# EasyEDA schematic HW_SCH.json
TITLE: Sheet_1; REV: 1.0; Date: 2022-10-19; Sheet: 1/1; Drawn By: rohirto; Company: Your Company
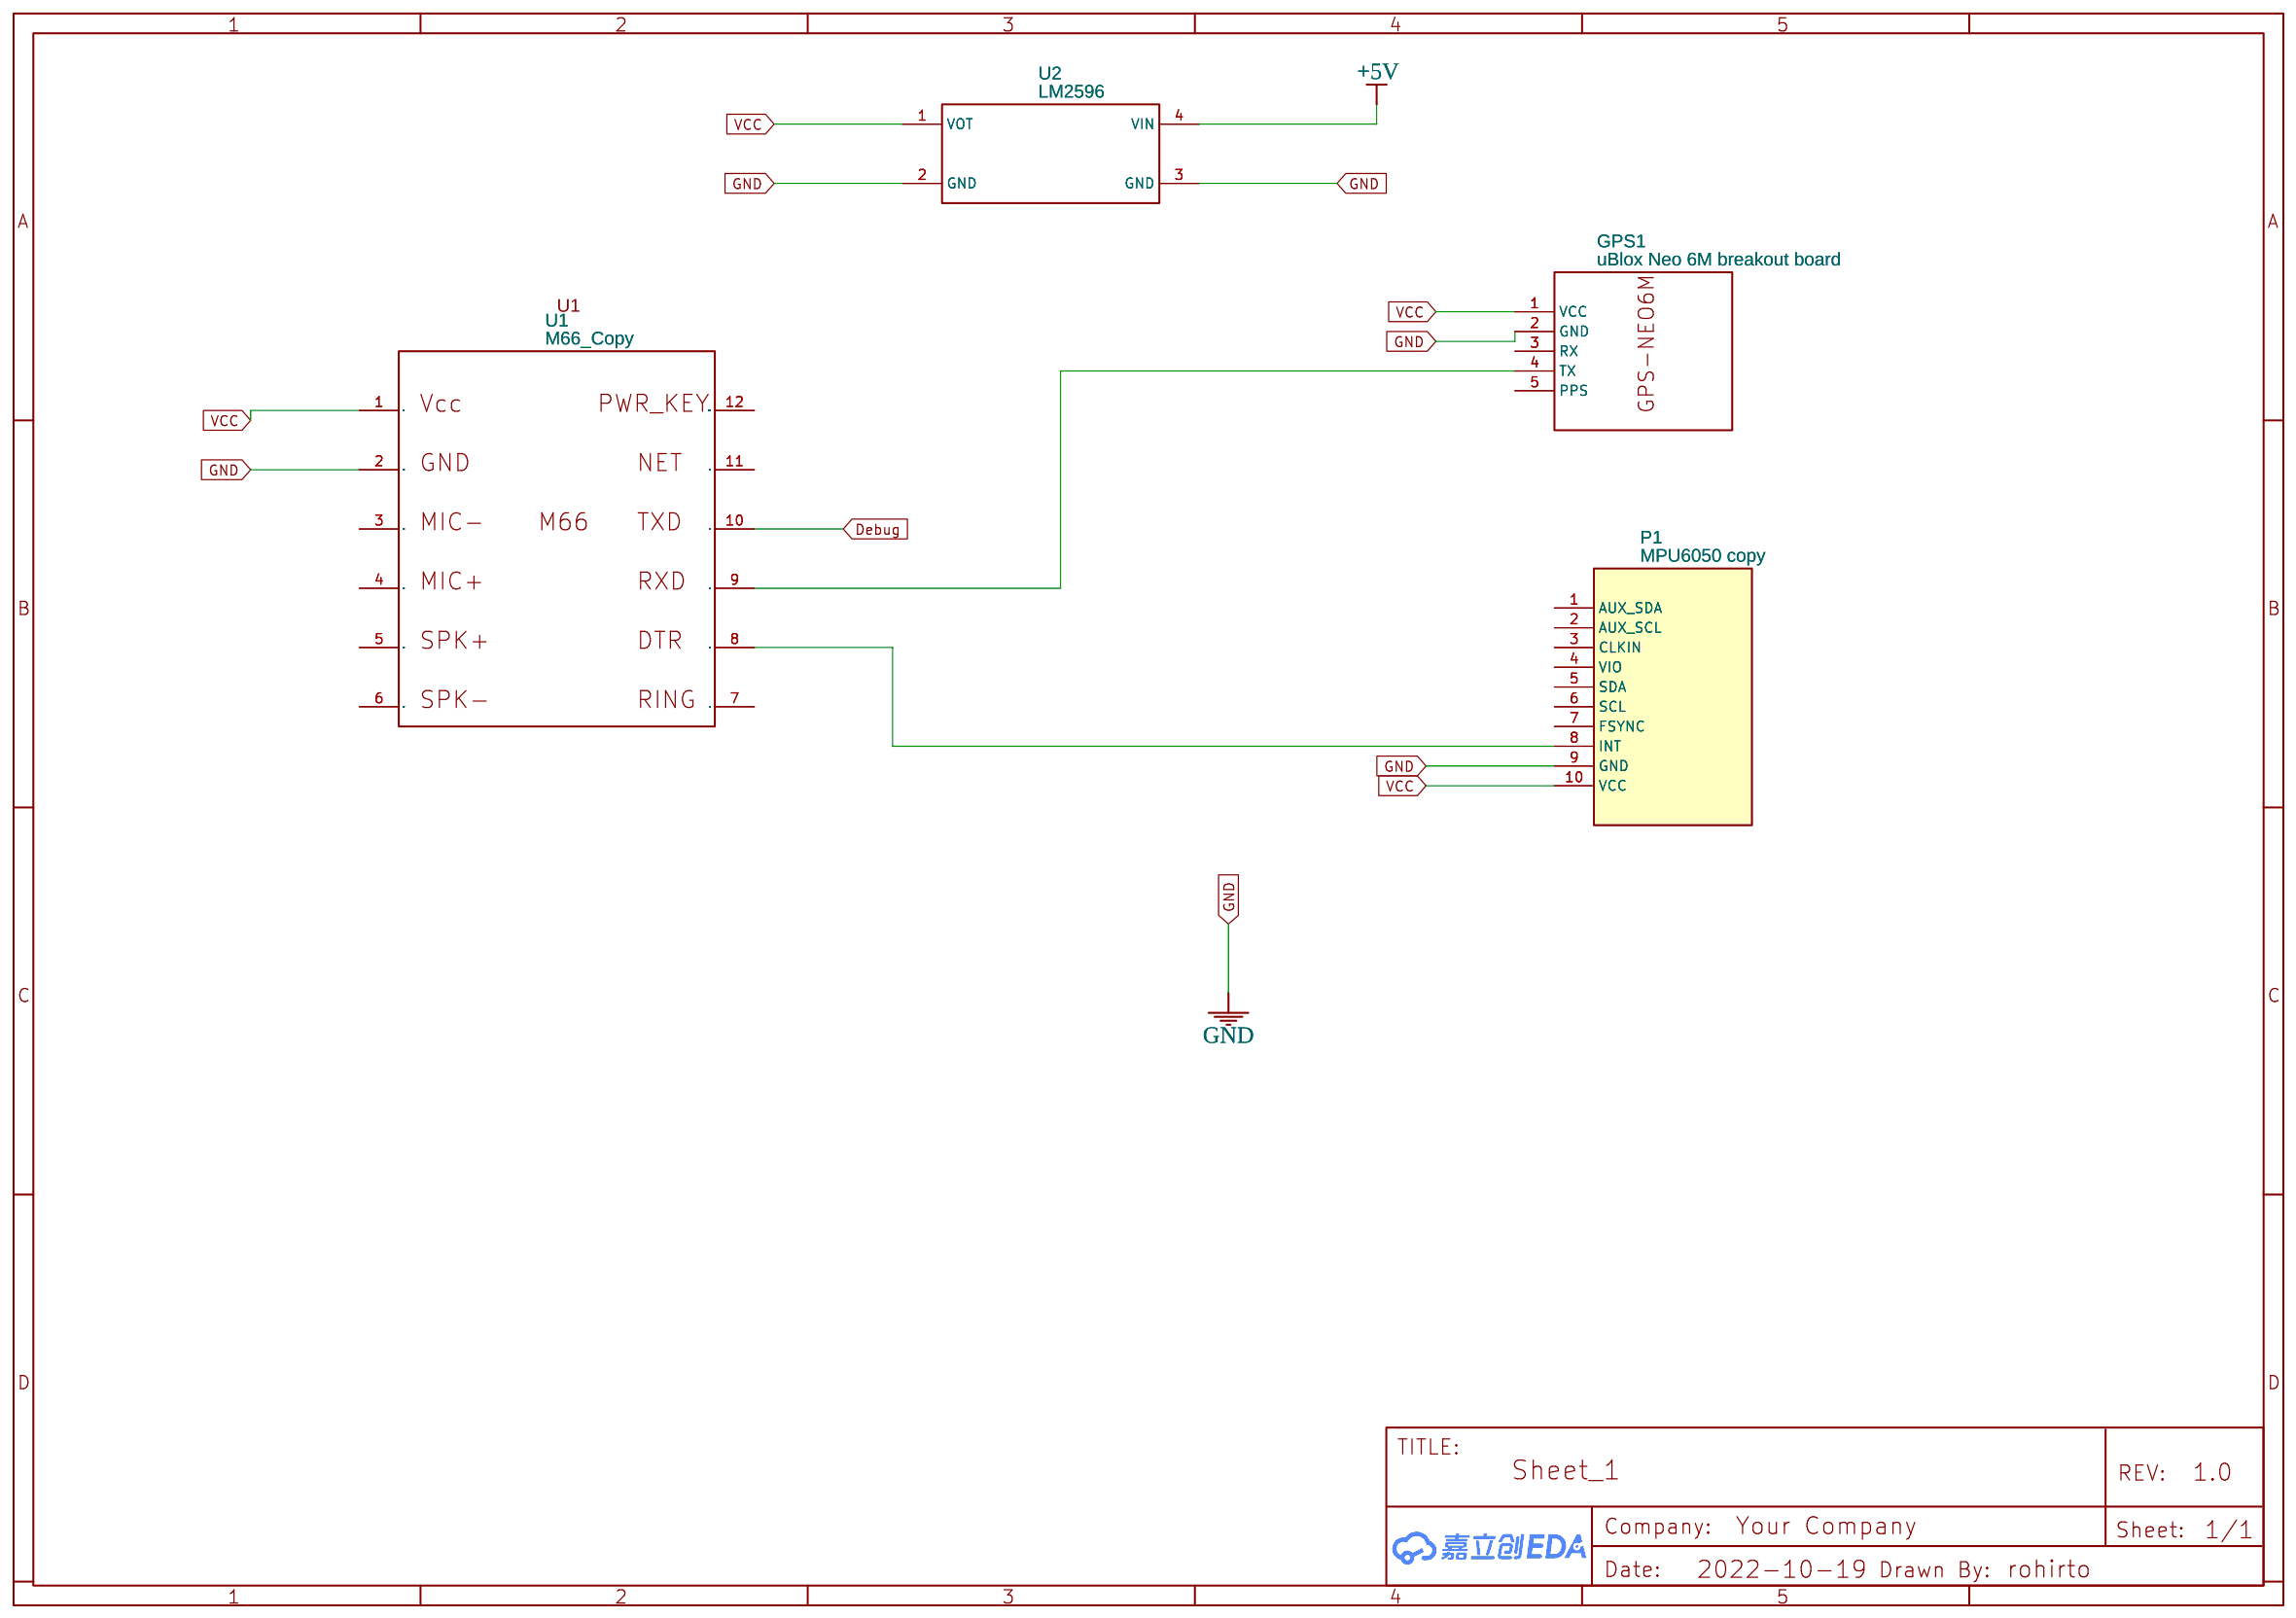
[diagram p0: schematic sheet]

## Parts
GPS1  uBlox Neo 6M breakout board  [GY-NEO6MV2]
P1  MPU6050 copy  [MPU6050]
U1  M66_Copy  [EVELTA_M66]
U2  LM2596  [LM2596]

## Library data of the parts
GPS1 = uBlox Neo 6M breakout board: Manufacturer Part: GY-NEO6M; Contributor: olex
P1 = MPU6050 copy: sourceId: 1T5FDZYC8
U1 = M66_Copy: Manufacturer: Quectel; Manufacturer Part: M66; Supplier: evelta; Supplier Part: 004-CM-10112; Contributor: rohirto
U2 = LM2596: Contributor: ecrmmwer

## Nets
+5V: U2.4(VIN)
GND: GPS1.2(GND) P1.9(GND) U1.2(GND) U2.2(GND) U2.3(GND)
VCC: GPS1.1(VCC) P1.10(VCC) U1.1(Vcc) U2.1(VOT)
Debug: U1.10(TXD)
Net-(GPS1-4): GPS1.4(TX) U1.9(RXD)
Net-(P1-8): P1.8(INT) U1.8(DTR)

Not connected (* = marked no-connect by the designer): GPS1 3(RX) 5(PPS); P1 1(AUX_SDA) 2(AUX_SCL) 3(CLKIN) 4(VIO) 5(SDA) 6(SCL) 7(FSYNC); U1 3(MIC -) 4(MIC+) 5(SPK+) 6(SPK-) 7(RI) 11(NET) 12(PWR_KEY)
